# Altium project MiniPC MB GOST.PrjPcb (part 23 of 31)

## Sheet SFP Connector.SchDoc
size 209 x 297 mm; Author: ALTIUM GOSTBOM2.0 KEV; SheetNumber: 31; SheetTotal: 48
Used 2 times, as channels A10/AB17, A10/AB18. Parts and nets are listed once, with the designators drawn on the sheet.
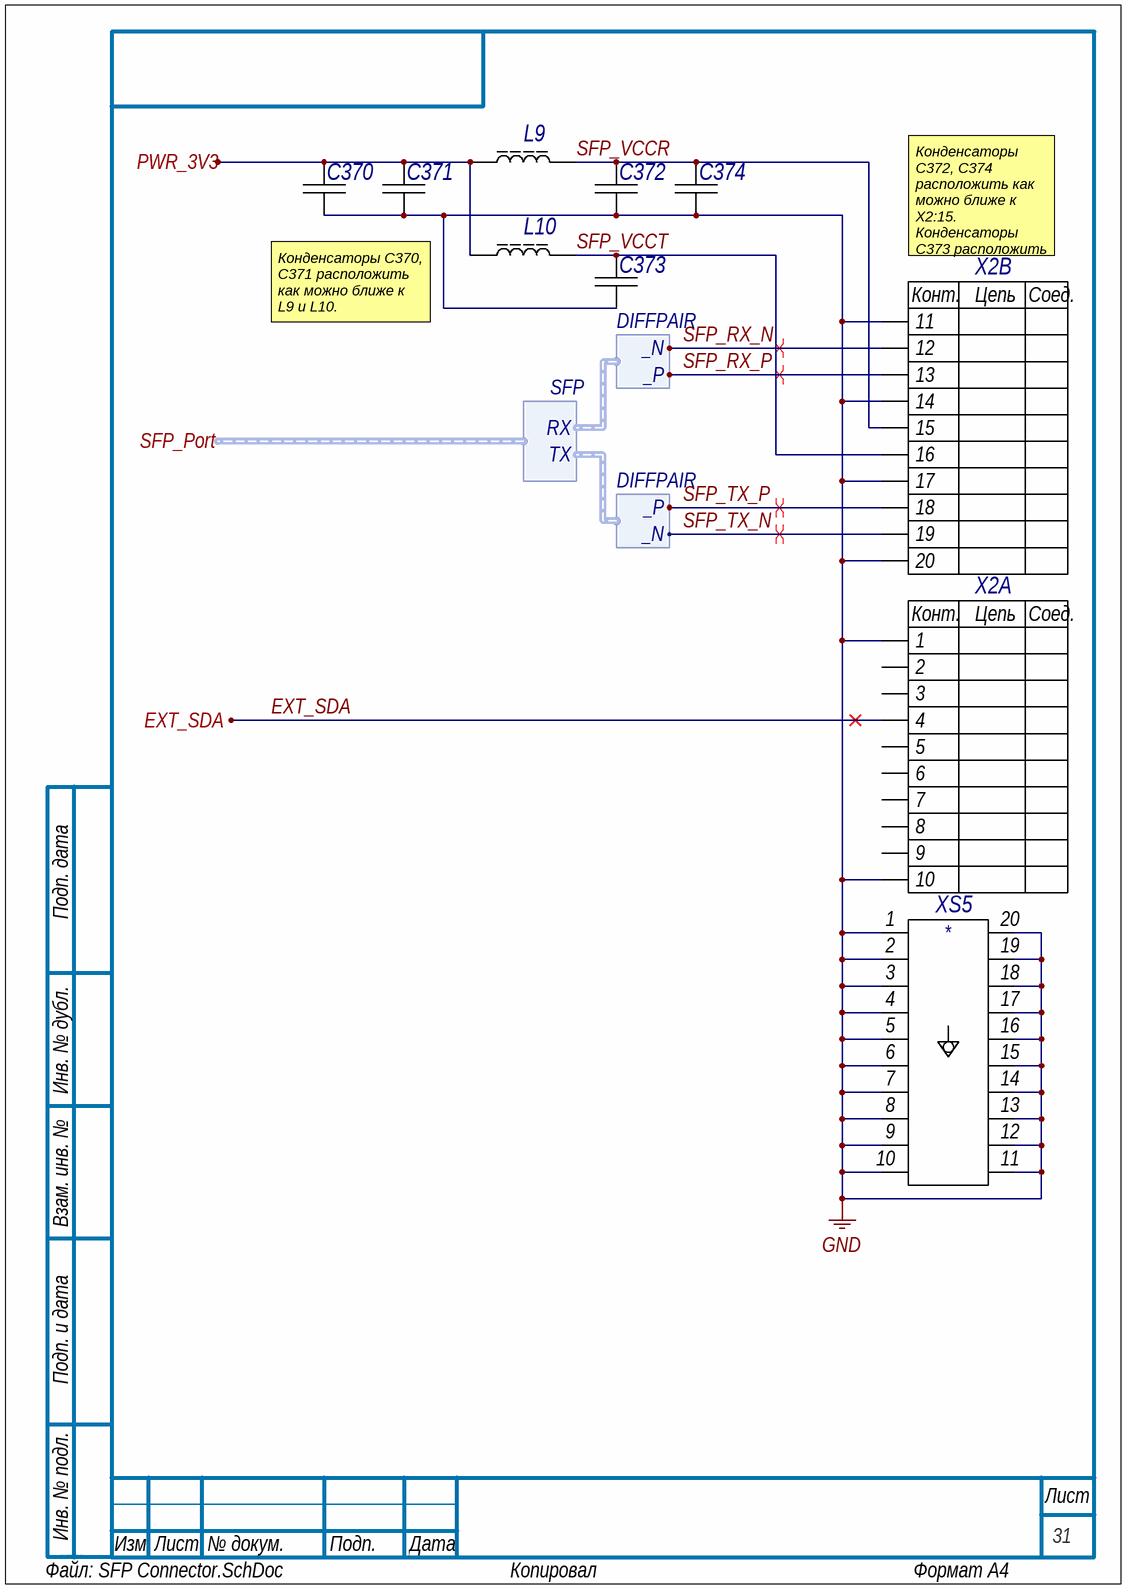
[diagram p32: SFP Connector.SchDoc]

### Parts
C370  C1005X7R1E104M  [CAPC1005X55X10LL05]  (value not drawn)
C371  C2012X5R1C106K085AC  [CAPC2013X100X20NL20]  (value not drawn)
C372  C1005X7R1E104M  [CAPC1005X55X10LL05]  (value not drawn)
C373  C1005X7R1E104M  [CAPC1005X55X10LL05]  (value not drawn)
C374  C2012X5R1C106K085AC  [CAPC2013X100X20NL20]  (value not drawn)
L9  1008CS-102XFLC  [COIL-1008CS_V]  (value not drawn)
L10  1008CS-102XFLC  [COIL-1008CS_V]  (value not drawn)
X2  MECT-110-01-M-D-RA1  [SMTC-MECT-110-01-M-D-RA1_V]  (value not drawn)  (parts A,B of 2)
XS5  74754-0101  [MOLX-74754-0101_V]  (value not drawn)

### Ports
EXT_SDA, PWR_3V3, SFP_Port (harness SFP)

### Harnesses
DIFFPAIR: _P, _N
SFP: RX, TX

### Nets
GND: C370.1 C371.1 C372.1 C373.1 C374.1 X2.1 X2.10 X2.11 X2.14 X2.17 X2.20 XS5.1 XS5.2 XS5.3 XS5.4 XS5.5 XS5.6 XS5.7 XS5.8 XS5.9 XS5.10 XS5.11 XS5.12 XS5.13 XS5.14 XS5.15 XS5.16 XS5.17 XS5.18 XS5.19 XS5.20
EXT_SDA: X2.4 ; port EXT_SDA
PWR_3V3: C370.2 C371.2 L9.1 L10.1 ; port PWR_3V3
SFP_RX_N: X2.12 ; harness DIFFPAIR._N
SFP_RX_P: X2.13 ; harness DIFFPAIR._P
SFP_TX_N: X2.19 ; harness DIFFPAIR._N
SFP_TX_P: X2.18 ; harness DIFFPAIR._P
SFP_VCCR: C372.2 C374.2 L9.2 X2.15  [project net SFP_VCCR_31]
SFP_VCCT: C373.2 L10.2 X2.16  [project net SFP_VCCT_31]

Not connected (* = marked no-connect by the designer): X2 2 3 5 6 7 8 9

### Channels
A10/AB17: designators C370=AB1C370 C371=AB1C371 C372=AB1C372 C373=AB1C373 C374=AB1C374 L9=AB1L9 L10=AB1L10 X2=AB1X2 XS5=AB1XS5; ports EXT_SDA=EXT_SDA PWR_3V3=IO_3V3
A10/AB18: designators C370=AB2C370 C371=AB2C371 C372=AB2C372 C373=AB2C373 C374=AB2C374 L9=AB2L9 L10=AB2L10 X2=AB2X2 XS5=AB2XS5; ports EXT_SDA=EXT_SDA_AB18 PWR_3V3=IO_3V3

### Layout directives
differential pair: SFP_RX_N_AB17, SFP_RX_P_AB17, SFP_TX_N_AB17, SFP_TX_P_AB17

### Notes on the sheet
- Конденсаторы C372, C374 расположить как можно ближе к X2:15.
  Конденсаторы C373 расположить как можно ближе к X2:16.
- Конденсаторы C370, C371 расположить как можно ближе к L9 и L10.
- Подп. дата
- Инв. № дубл.
- Взам. инв. №
- Подп. и дата
- Инв. № подл.
- Изм.
- Лист
- № докум.
- Подп.
- Дата
- Файл:
- ALTIUM GOSTBOM2.0 KEV
- Копировал
- Формат А4
- (in symbol E35, part A) Конт.; Цепь; Соед.
- (in symbol E35, part B) Конт.; Цепь; Соед.

### Library data of the parts
C370 = E11: Chip Capacitor, 0.1 uF, +/- 20%, 25 V, -55 to 125 degC, 0402 (1005 Metric), RoHS, Tape and Reel; Тип элемента: Конденсатор; Capacitance: 100 nF; Case\/Package: 0402; Type (Capacitors): X7R; Voltage Rating: 25 V; Old_des: C551; New_des: C379; UID: E11; Component Kind: Standard; Case Code (Imperial): 0402; Case Code (Metric): 1005; ComponentLink1Description: Manufacturer URL; ComponentLink1URL: http://www.tdk.com/; ComponentLink2Description: Datasheet; ComponentLink2URL: http://www.farnell.com/datasheets/1571323.pdf; DatasheetVersion: 09/2011; Length: 1 mm; Max Operating Temperature: 125 degC; Min Operating Temperature: -55 degC; Mounting Technology: Surface Mount; Package Quantity: 10000; PackageDescription: 2-Pin Surface Mount Device, Body 1 x 0.5 mm; Packaging: Tape and Reel; PartNumber: C1005X7R1E104M; RoHSCompliant: true; Tolerance: 20%; Width: 0.5 mm; Height: 0.5 mm; Mount: Surface Mount; PackageReference: 0402; Pins: 2; Voltage Rating (DC): 25 V
C371 = E25: Chip Capacitor, 10 uF, +/- 10%, 16 V, -55 to 85 degC, 0805 (2012 Metric), RoHS, Tape and Reel; Тип элемента: Конденсатор; Capacitance: 10 uF; Case\/Package: 0805; Type (Capacitors): X5R; Voltage Rating: 16 V; Old_des: C552; New_des: C380; UID: E25; Component Kind: Standard; Case Code (Imperial): 0805; Case Code (Metric): 2012; ComponentLink1Description: Manufacturer URL; ComponentLink1URL: http://www.tdk.com/; ComponentLink2Description: Datasheet; ComponentLink2URL: https://product.tdk.com/info/en/catalog/datasheets/mlcc_commercial_general_en.pdf; DatasheetVersion: 03/2015; Length: 2 mm; Max Operating Temperature: 85 degC; Min Operating Temperature: -55 degC; Mounting Technology: Surface Mount; Package Quantity: 1; PackageDescription: 2-Pin Surface Mount Device, Body 2 x 1.25 mm; Packaging: Tape and Reel; RoHSCompliant: true; Tolerance: 10%; Width: 1.25 mm; Height: 0.85 mm; Mount: Surface Mount; PackageReference: 0805; Pins: 2; REACH SVHC: No SVHC; Voltage Rating (DC): 16 V
C372 = E11: Chip Capacitor, 0.1 uF, +/- 20%, 25 V, -55 to 125 degC, 0402 (1005 Metric), RoHS, Tape and Reel; Тип элемента: Конденсатор; Capacitance: 100 nF; Case\/Package: 0402; Type (Capacitors): X7R; Voltage Rating: 25 V; Old_des: C553; New_des: C381; UID: E11; Component Kind: Standard; Case Code (Imperial): 0402; Case Code (Metric): 1005; ComponentLink1Description: Manufacturer URL; ComponentLink1URL: http://www.tdk.com/; ComponentLink2Description: Datasheet; ComponentLink2URL: http://www.farnell.com/datasheets/1571323.pdf; DatasheetVersion: 09/2011; Length: 1 mm; Max Operating Temperature: 125 degC; Min Operating Temperature: -55 degC; Mounting Technology: Surface Mount; Package Quantity: 10000; PackageDescription: 2-Pin Surface Mount Device, Body 1 x 0.5 mm; Packaging: Tape and Reel; PartNumber: C1005X7R1E104M; RoHSCompliant: true; Tolerance: 20%; Width: 0.5 mm; Height: 0.5 mm; Mount: Surface Mount; PackageReference: 0402; Pins: 2; Voltage Rating (DC): 25 V
C373 = E11: Chip Capacitor, 0.1 uF, +/- 20%, 25 V, -55 to 125 degC, 0402 (1005 Metric), RoHS, Tape and Reel; Тип элемента: Конденсатор; Capacitance: 100 nF; Case\/Package: 0402; Type (Capacitors): X7R; Voltage Rating: 25 V; Old_des: C550; New_des: C382; UID: E11; Component Kind: Standard; Case Code (Imperial): 0402; Case Code (Metric): 1005; ComponentLink1Description: Manufacturer URL; ComponentLink1URL: http://www.tdk.com/; ComponentLink2Description: Datasheet; ComponentLink2URL: http://www.farnell.com/datasheets/1571323.pdf; DatasheetVersion: 09/2011; Length: 1 mm; Max Operating Temperature: 125 degC; Min Operating Temperature: -55 degC; Mounting Technology: Surface Mount; Package Quantity: 10000; PackageDescription: 2-Pin Surface Mount Device, Body 1 x 0.5 mm; Packaging: Tape and Reel; PartNumber: C1005X7R1E104M; RoHSCompliant: true; Tolerance: 20%; Width: 0.5 mm; Height: 0.5 mm; Mount: Surface Mount; PackageReference: 0402; Pins: 2; Voltage Rating (DC): 25 V
C374 = E25: Chip Capacitor, 10 uF, +/- 10%, 16 V, -55 to 85 degC, 0805 (2012 Metric), RoHS, Tape and Reel; Тип элемента: Конденсатор; Capacitance: 10 uF; Case\/Package: 0805; Type (Capacitors): X5R; Voltage Rating: 16 V; Old_des: C554; New_des: C383; UID: E25; Component Kind: Standard; Case Code (Imperial): 0805; Case Code (Metric): 2012; ComponentLink1Description: Manufacturer URL; ComponentLink1URL: http://www.tdk.com/; ComponentLink2Description: Datasheet; ComponentLink2URL: https://product.tdk.com/info/en/catalog/datasheets/mlcc_commercial_general_en.pdf; DatasheetVersion: 03/2015; Length: 2 mm; Max Operating Temperature: 85 degC; Min Operating Temperature: -55 degC; Mounting Technology: Surface Mount; Package Quantity: 1; PackageDescription: 2-Pin Surface Mount Device, Body 2 x 1.25 mm; Packaging: Tape and Reel; RoHSCompliant: true; Tolerance: 10%; Width: 1.25 mm; Height: 0.85 mm; Mount: Surface Mount; PackageReference: 0805; Pins: 2; REACH SVHC: No SVHC; Voltage Rating (DC): 16 V
L9 = E49: Chip Inductor, 1000 nH, +/- 1%, -40 to 125 degC, 2-Pin SMD, RoHS, Tape and Reel; Тип элемента: Ферритовый дроссель; Inductance: 1000 nH; Old_des: L24; New_des: L10; UID: E49; Component Kind: Standard; ComponentLink1Description: Manufacturer URL; ComponentLink1URL: http://www.coilcraft.com/; ComponentLink2Description: Datasheet; ComponentLink2URL: http://datasheet.octopart.com/1008CS-102XFLC-Coilcraft-datasheet-10791557.pdf; DatasheetVersion: 01/2012; Mounting Technology: Surface Mount; PackageDescription: 2-Pin Surface Mount Device, Body 2.92 x 2.79 mm; PartNumber: 1008CS-102XFLC; RoHSCompliant: False
L10 = E49: Chip Inductor, 1000 nH, +/- 1%, -40 to 125 degC, 2-Pin SMD, RoHS, Tape and Reel; Тип элемента: Ферритовый дроссель; Inductance: 1000 nH; Old_des: L23; New_des: L11; UID: E49; Component Kind: Standard; ComponentLink1Description: Manufacturer URL; ComponentLink1URL: http://www.coilcraft.com/; ComponentLink2Description: Datasheet; ComponentLink2URL: http://datasheet.octopart.com/1008CS-102XFLC-Coilcraft-datasheet-10791557.pdf; DatasheetVersion: 01/2012; Mounting Technology: Surface Mount; PackageDescription: 2-Pin Surface Mount Device, Body 2.92 x 2.79 mm; PartNumber: 1008CS-102XFLC; RoHSCompliant: False
X2 = E35: Female Transceiver Interface, Pitch 0.8 mm, 2 x 10 Position, Height 5.2 mm, -55 to 125 degC, RoHS, Tube; Manufacturer: Samtec; Тип элемента: Соединитель; Old_des: J7; New_des: X2; UID: E35; Component Kind: Standard; ComponentLink1Description: Manufacturer URL; ComponentLink1URL: http://www.samtec.com/; ComponentLink2Description: Datasheet; ComponentLink2URL: http://suddendocs.samtec.com/catalog_english/mect.pdf; DatasheetVersion: Rev. Feb-16; Mounting Technology: Surface Mount; PackageDescription: Female Transceiver Interface, Pitch 0.8 mm, 2 x 10 Position, Height 5.2 mm; PartNumber: MECT-110-01-M-D-RA1; PackageReference: MECT-110-01-M-D-RA1; ComponentLink3Description: Package Specification; ComponentLink3URL: http://suddendocs.samtec.com/prints/mect-1xx-xx-xx-xx-d-rax-xx-footprint.pdf; PackageVersion: Rev. H, 06/2016
XS5 = E1: SFP+ Cage, Single Port, Height 10.85 mm, Tail Height 3.05 mm, -40 to 85 degC, RoHS, Tray; Manufacturer: Molex; Тип элемента: Корзина соединителя; Old_des: B1; New_des: XS5; UID: E1; Component Kind: Standard; ComponentLink1Description: Manufacturer URL; ComponentLink1URL: http://www.molex.com/; ComponentLink2Description: Datasheet; ComponentLink2URL: http://www.molex.com/webdocs/datasheets/pdf/en-us/0747540101_IO_CONNECTORS.pdf; DatasheetVersion: Rev. Jul-15; Mounting Technology: Through Hole; PackageDescription: SFP+ Cage, Single Port, Height 10.85 mm, Tail Height 3.05 mm; PartNumber: 74754-0101; PackageReference: 74754-0101; ComponentLink3Description: Package Specification; ComponentLink3URL: http://www.molex.com/pdm_docs/sd/747540101_sd.pdf; PackageVersion: Rev. J, 02/2015

## Sheet USB3 Interface.SchDoc
size 420 x 297 mm; Author: ALTIUM GOSTBOM2.0 KEV; SheetNumber: 47; SheetTotal: 48
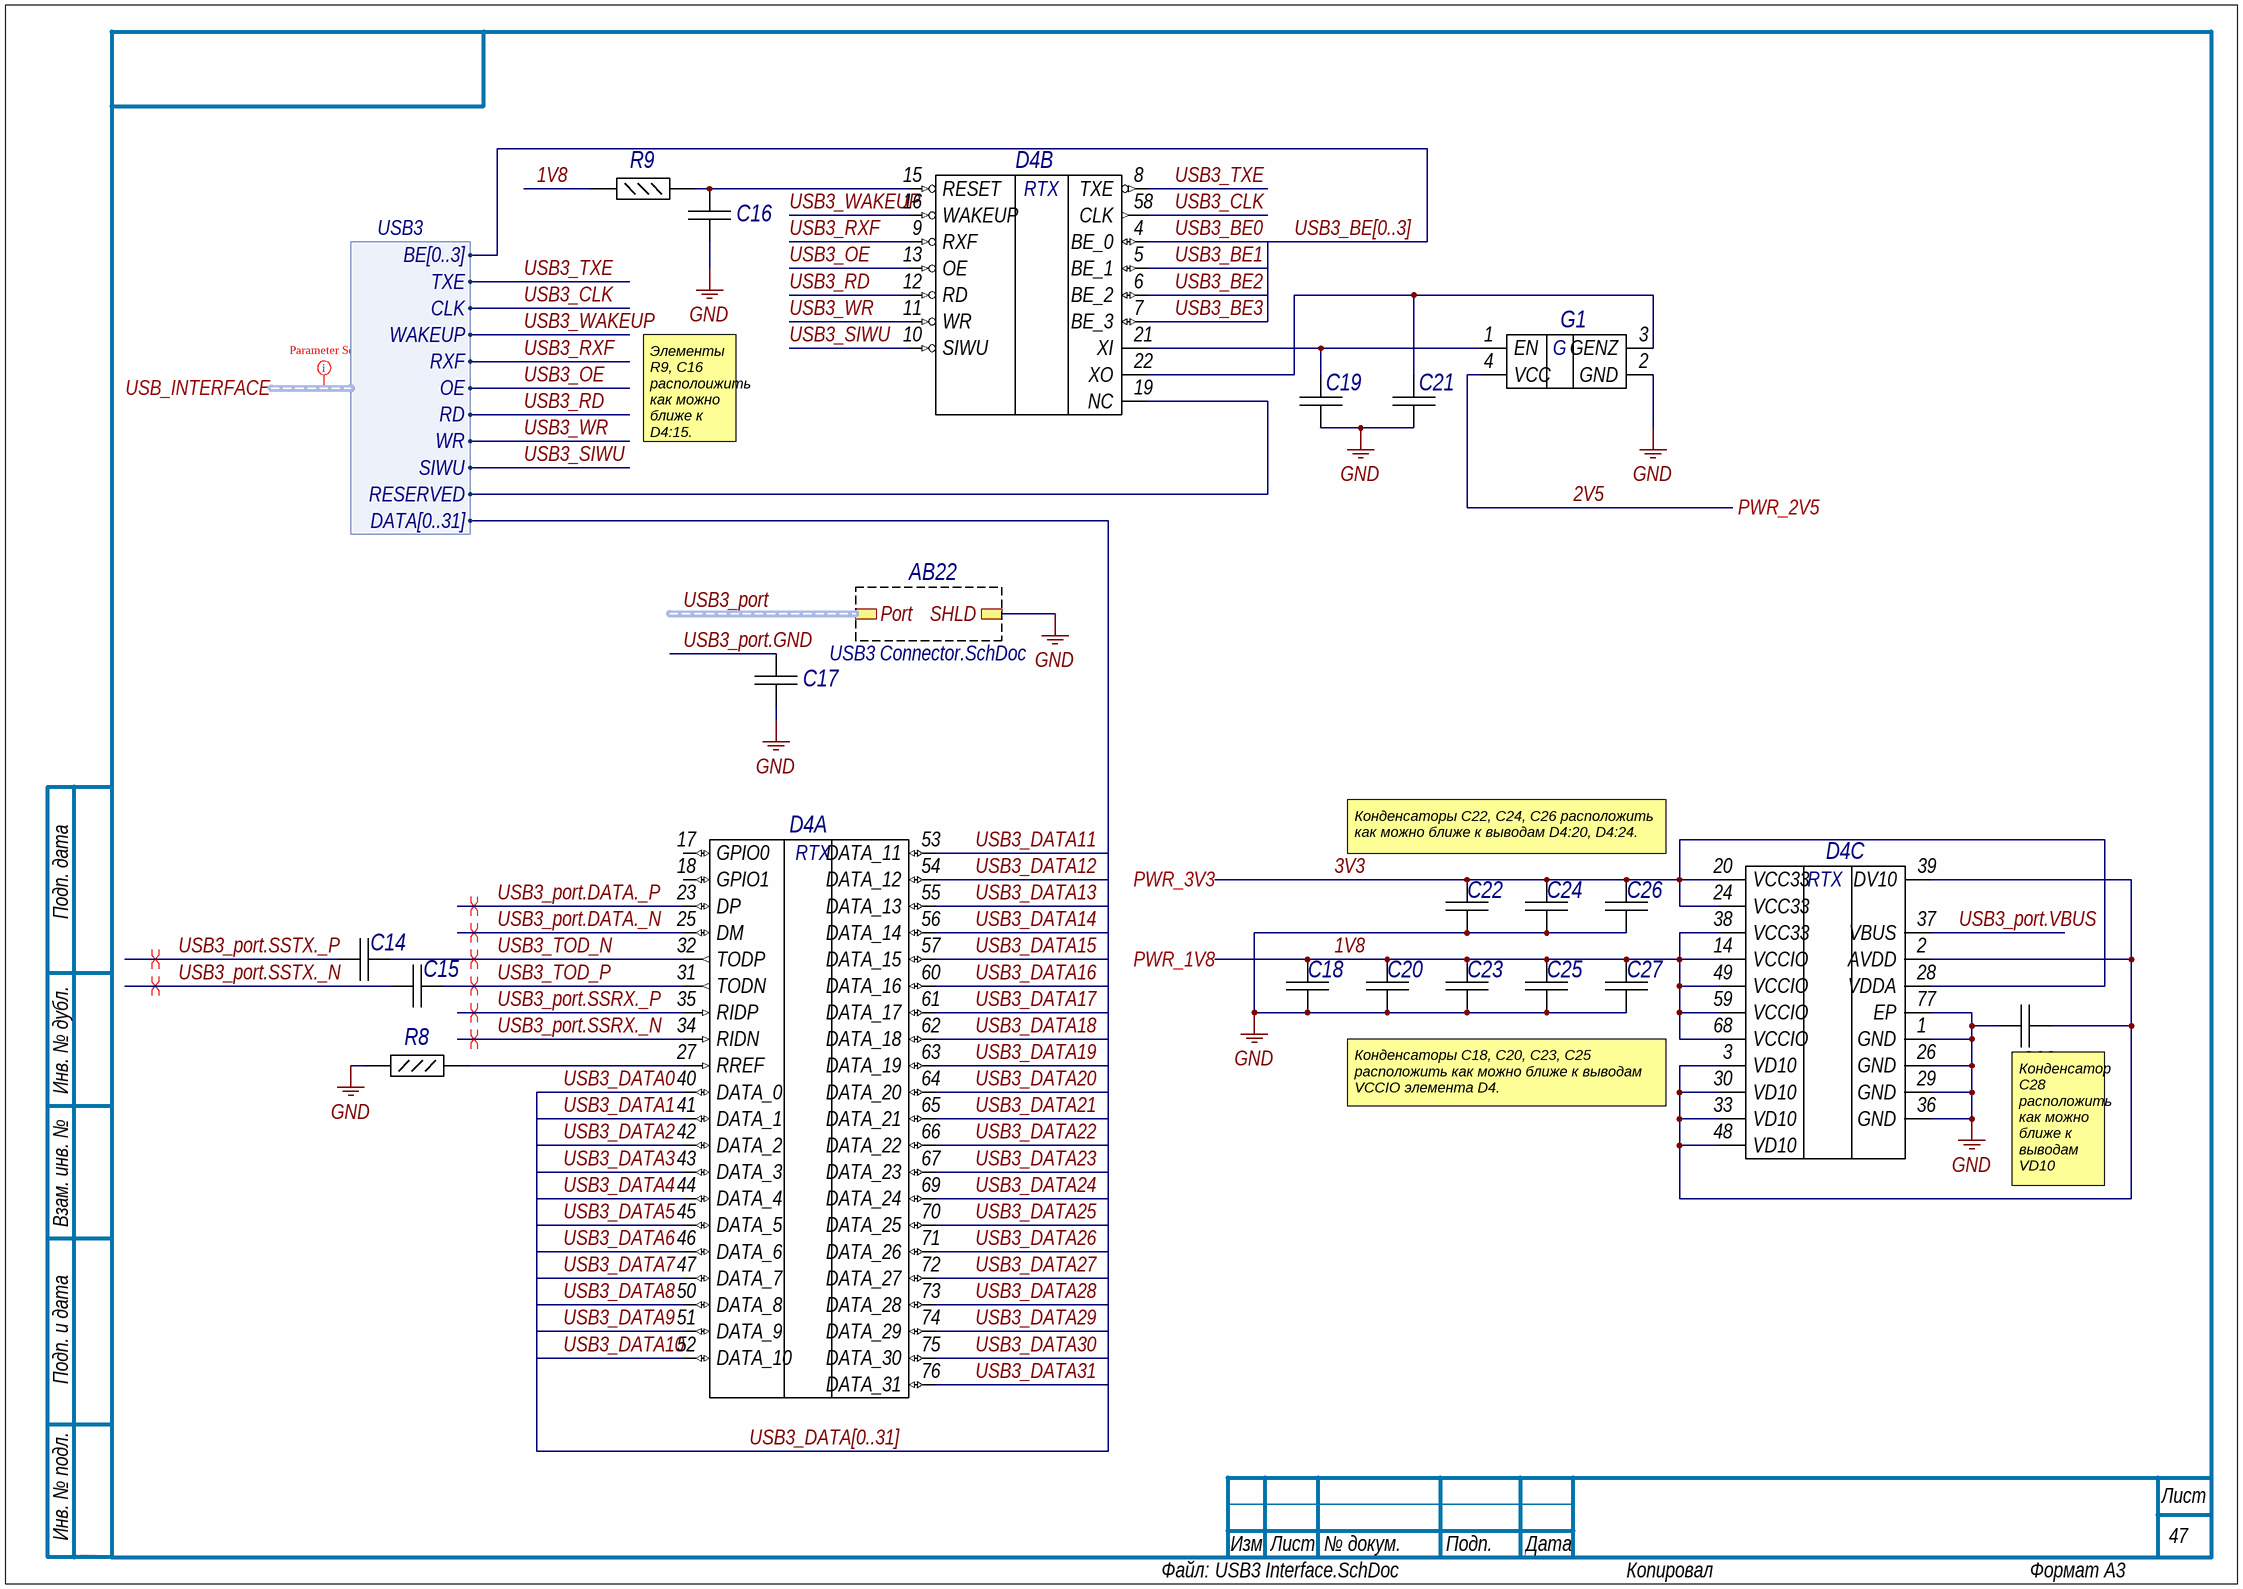
[diagram p33: USB3 Interface.SchDoc]

### Parts
C14  GRM033R60J104KE19D  [CAPC0603X33X15LL03T05]  (value not drawn)
C15  GRM033R60J104KE19D  [CAPC0603X33X15LL03T05]  (value not drawn)
C16  GRM033R60J104KE19D  [CAPC0603X33X15LL03T05]  (value not drawn)
C17  GRM033R60J104KE19D  [CAPC0603X33X15LL03T05]  (value not drawn)
C18  C1005X7R1E104M  [CAPC1005X55X10LL05]  (value not drawn)
C19  GRM033R60J104KE19D  [CAPC0603X33X15LL03T05]  (value not drawn)
C20  C1005X7R1E104M  [CAPC1005X55X10LL05]  (value not drawn)
C21  GRM033R60J104KE19D  [CAPC0603X33X15LL03T05]  (value not drawn)
C22  C1005X7R1E104M  [CAPC1005X55X10LL05]  (value not drawn)
C23  C1005X7R1E104M  [CAPC1005X55X10LL05]  (value not drawn)
C24  C1005X7R1E104M  [CAPC1005X55X10LL05]  (value not drawn)
C25  C1005X7R1E104M  [CAPC1005X55X10LL05]  (value not drawn)
C26  C1005X7R1E104M  [CAPC1005X55X10LL05]  (value not drawn)
C27  C1005X7R1E104M  [CAPC1005X55X10LL05]  (value not drawn)
C28  GRM033R60J104KE19D  [CAPC0603X33X15LL03T05]  (value not drawn)
D4  FT601Q  [FTDI-QFN-76_M]  (value not drawn)  (parts A,B,C of 3)
G1  ASE2-33.000MHZ-ET  [ABRA-ASE2_V]  (value not drawn)
R8  ERJ-2RKF1651X  [RESC1005X40X25LL05T05]  (value not drawn)
R9  ERJ-2RKF1002X  [RESC1005X40X25LL05T05]  (value not drawn)

### Sub-sheets
AB22 = USB3 Connector.SchDoc: Port (harness USB3_typeA), SHLD

### Ports
PWR_1V8, PWR_2V5, PWR_3V3, USB_INTERFACE (harness USB3)

### Harnesses
USB3: DATA[0..31], BE[0..3], TXE, CLK, WAKEUP, RXF, OE, RD, WR, SIWU, RESERVED

### Nets
GND: C16.1 C17.1 C18.1 C19.1 C20.1 C21.1 C22.1 C23.1 C24.1 C25.1 C26.1 C27.1 C28.2 D4.1(GND) D4.26(GND) D4.29(GND) D4.36(GND) D4.77(EP) G1.2(GND) R8.2 ; sheet AB22/SHLD
1V8: C18.2 C20.2 C23.2 C25.2 C27.2 D4.14(VCCIO) D4.38(VCC33) D4.49(VCCIO) D4.59(VCCIO) D4.68(VCCIO) R9.1 ; port PWR_1V8  [project net IO_1V8]
2V5: G1.4(VCC) ; port PWR_2V5  [project net IO_2V5]
3V3: C22.2 C24.2 C26.2 D4.20(VCC33) D4.24(VCC33) D4.28(VDDA) ; port PWR_3V3  [project net IO_3V3]
USB3_BE0: D4.4(BE_0)  [project net USB3_BE0_47]
USB3_BE1: D4.5(BE_1)  [project net USB3_BE1_47]
USB3_BE2: D4.6(BE_2)  [project net USB3_BE2_47]
USB3_BE3: D4.7(BE_3)  [project net USB3_BE3_47]
USB3_CLK: D4.58(CLK) ; port USB_INTERFACE.CLK
USB3_DATA0: D4.40(DATA_0)  [project net USB3_DATA0_47]
USB3_DATA1: D4.41(DATA_1)  [project net USB3_DATA1_47]
USB3_DATA2: D4.42(DATA_2)  [project net USB3_DATA2_47]
USB3_DATA3: D4.43(DATA_3)  [project net USB3_DATA3_47]
USB3_DATA4: D4.44(DATA_4)  [project net USB3_DATA4_47]
USB3_DATA5: D4.45(DATA_5)  [project net USB3_DATA5_47]
USB3_DATA6: D4.46(DATA_6)  [project net USB3_DATA6_47]
USB3_DATA7: D4.47(DATA_7)  [project net USB3_DATA7_47]
USB3_DATA8: D4.50(DATA_8)  [project net USB3_DATA8_47]
USB3_DATA9: D4.51(DATA_9)  [project net USB3_DATA9_47]
USB3_DATA10: D4.52(DATA_10)  [project net USB3_DATA10_47]
USB3_DATA11: D4.53(DATA_11)  [project net USB3_DATA11_47]
USB3_DATA12: D4.54(DATA_12)  [project net USB3_DATA12_47]
USB3_DATA13: D4.55(DATA_13)  [project net USB3_DATA13_47]
USB3_DATA14: D4.56(DATA_14)  [project net USB3_DATA14_47]
USB3_DATA15: D4.57(DATA_15)  [project net USB3_DATA15_47]
USB3_DATA16: D4.60(DATA_16)  [project net USB3_DATA16_47]
USB3_DATA17: D4.61(DATA_17)  [project net USB3_DATA17_47]
USB3_DATA18: D4.62(DATA_18)  [project net USB3_DATA18_47]
USB3_DATA19: D4.63(DATA_19)  [project net USB3_DATA19_47]
USB3_DATA20: D4.64(DATA_20)  [project net USB3_DATA20_47]
USB3_DATA21: D4.65(DATA_21)  [project net USB3_DATA21_47]
USB3_DATA22: D4.66(DATA_22)  [project net USB3_DATA22_47]
USB3_DATA23: D4.67(DATA_23)  [project net USB3_DATA23_47]
USB3_DATA24: D4.69(DATA_24)  [project net USB3_DATA24_47]
USB3_DATA25: D4.70(DATA_25)  [project net USB3_DATA25_47]
USB3_DATA26: D4.71(DATA_26)  [project net USB3_DATA26_47]
USB3_DATA27: D4.72(DATA_27)  [project net USB3_DATA27_47]
USB3_DATA28: D4.73(DATA_28)  [project net USB3_DATA28_47]
USB3_DATA29: D4.74(DATA_29)  [project net USB3_DATA29_47]
USB3_DATA30: D4.75(DATA_30)  [project net USB3_DATA30_47]
USB3_DATA31: D4.76(DATA_31)  [project net USB3_DATA31_47]
USB3_OE: D4.13(OE) ; port USB_INTERFACE.OE
USB3_port.DATA._N: D4.25(DM)  [project net USB3_port.DATA._N_47]
USB3_port.DATA._P: D4.23(DP)  [project net USB3_port.DATA._P_47]
USB3_port.GND: C17.2  [project net USB3_port.GND_47]
USB3_port.SSRX._N: D4.34(RIDN)  [project net USB3_port.SSRX._N_47]
USB3_port.SSRX._P: D4.35(RIDP)  [project net USB3_port.SSRX._P_47]
USB3_port.SSTX._N: C15.2  [project net USB3_port.SSTX._N_47]
USB3_port.SSTX._P: C14.2  [project net USB3_port.SSTX._P_47]
USB3_port.VBUS: D4.37(VBUS)  [project net USB3_port.VBUS_47]
USB3_RD: D4.12(RD) ; port USB_INTERFACE.RD
USB3_RXF: D4.9(RXF) ; port USB_INTERFACE.RXF
USB3_SIWU: D4.10(SIWU) ; port USB_INTERFACE.SIWU
USB3_TOD_N: C14.1 D4.32(TODP)  [project net USB3_TOD_N_47]
USB3_TOD_P: C15.1 D4.31(TODN)  [project net USB3_TOD_P_47]
USB3_TXE: D4.8(TXE) ; port USB_INTERFACE.TXE
USB3_WAKEUP: D4.16(WAKEUP) ; port USB_INTERFACE.WAKEUP
USB3_WR: D4.11(WR) ; port USB_INTERFACE.WR
NetC16_2: C16.2 D4.15(RESET) R9.2
NetC19_2: C19.2 D4.21(XI) G1.1(EN)
NetC21_2: C21.2 D4.22(XO) G1.3(GENZ)
NetC28_1: C28.1 D4.2(AVDD) D4.3(VD10) D4.30(VD10) D4.33(VD10) D4.39(DV10) D4.48(VD10)
NetD4_19: D4.19(NC) ; port USB_INTERFACE.RESERVED
NetD4_27: D4.27(RREF) R8.1

Not connected (* = marked no-connect by the designer): D4 17(GPIO0) 18(GPIO1)

### Buses and harness runs
bus USB3_BE[0..3]
bus USB3_DATA[0..31]
harness USB3_port = sheet AB22/Port

### Layout directives
differential pair: USB3_port.DATA._N_47, USB3_port.DATA._P_47, USB3_port.SSRX._N_47, USB3_port.SSRX._P_47, USB3_port.SSTX._N_47, USB3_port.SSTX._P_47, USB3_TOD_N_47, USB3_TOD_P_47
net class USB3: (no net found under the mark)

### Notes on the sheet
- Элементы R9, C16 располоижить как можно ближе к D4:15.
- Конденсаторы C22, C24, C26 расположить как можно ближе к выводам D4:20, D4:24.
- Конденсаторы C18, C20, C23, C25 расположить как можно ближе к выводам VCCIO элемента D4.
  Конденсатор C27 расположить как можно ближе к D4:28.
- (near C28) Конденсатор C28 расположить как можно ближе к выводам VD10 элемента D4.
- Подп. дата
- Инв. № дубл.
- Взам. инв. №
- Подп. и дата
- Инв. № подл.
- Изм.
- Лист
- № докум.
- Подп.
- Дата
- ALTIUM GOSTBOM2.0 KEV
- Файл:
- Копировал
- Формат А3
- (in symbol E127, part A) RTX
- (in symbol E127, part B) RTX
- (in symbol E127, part C) RTX
- (in symbol E128) G

### Library data of the parts
C14 = E22: Chip Capacitor, 100 nF, +/- 10%, 6.3 V, -55 to 85 degC, 0201 (0603 Metric), RoHS, Tape and Reel; Manufacturer: Basic Passives; Тип элемента: Конденсатор; Capacitance: 100 nF; Case\/Package: 0201; Type (Capacitors): X5R; Voltage Rating: 6.3 V; Voltage Rating (DC): 3 V; Old_des: C561; New_des: C14; UID: E22; Component Kind: Standard; Case Code (Imperial): 0201; Case Code (Metric): 0603; ComponentLink1Description: Manufacturer URL; ComponentLink1URL: http://www.murata.com/; ComponentLink2Description: Datasheet; ComponentLink2URL: http://search.murata.co.jp/Ceramy/image/img/A01X/G101/ENG/GRM033R60J104KE19-01.pdf; DatasheetVersion: 03/2016; Length: 0.6 mm; Max Operating Temperature: 85 degC; Min Operating Temperature: -55 degC; Mounting Technology: Surface Mount; Package Quantity: 15000; PackageDescription: 2-Pin Surface Mount Device, Body 0.6 x 0.3 mm; Packaging: Tape and Reel; PartNumber: GRM033R60J104KE19D; RoHSCompliant: true; Tolerance: 10%; Width: 0.3 mm; Height: 0.3 mm; Mount: Surface Mount; PackageReference: 0201; Pins: 2; Radiation Hardening: No; REACH SVHC: No SVHC
C15 = E22: Chip Capacitor, 100 nF, +/- 10%, 6.3 V, -55 to 85 degC, 0201 (0603 Metric), RoHS, Tape and Reel; Manufacturer: Basic Passives; Тип элемента: Конденсатор; Capacitance: 100 nF; Case\/Package: 0201; Type (Capacitors): X5R; Voltage Rating: 6.3 V; Voltage Rating (DC): 3 V; Old_des: C560; New_des: C15; UID: E22; Component Kind: Standard; Case Code (Imperial): 0201; Case Code (Metric): 0603; ComponentLink1Description: Manufacturer URL; ComponentLink1URL: http://www.murata.com/; ComponentLink2Description: Datasheet; ComponentLink2URL: http://search.murata.co.jp/Ceramy/image/img/A01X/G101/ENG/GRM033R60J104KE19-01.pdf; DatasheetVersion: 03/2016; Length: 0.6 mm; Max Operating Temperature: 85 degC; Min Operating Temperature: -55 degC; Mounting Technology: Surface Mount; Package Quantity: 15000; PackageDescription: 2-Pin Surface Mount Device, Body 0.6 x 0.3 mm; Packaging: Tape and Reel; PartNumber: GRM033R60J104KE19D; RoHSCompliant: true; Tolerance: 10%; Width: 0.3 mm; Height: 0.3 mm; Mount: Surface Mount; PackageReference: 0201; Pins: 2; Radiation Hardening: No; REACH SVHC: No SVHC
C16 = E22: Chip Capacitor, 100 nF, +/- 10%, 6.3 V, -55 to 85 degC, 0201 (0603 Metric), RoHS, Tape and Reel; Manufacturer: Basic Passives; Тип элемента: Конденсатор; Capacitance: 100 nF; Case\/Package: 0201; Type (Capacitors): X5R; Voltage Rating: 6.3 V; Voltage Rating (DC): 3 V; Old_des: C563; New_des: C16; UID: E22; Component Kind: Standard; Case Code (Imperial): 0201; Case Code (Metric): 0603; ComponentLink1Description: Manufacturer URL; ComponentLink1URL: http://www.murata.com/; ComponentLink2Description: Datasheet; ComponentLink2URL: http://search.murata.co.jp/Ceramy/image/img/A01X/G101/ENG/GRM033R60J104KE19-01.pdf; DatasheetVersion: 03/2016; Length: 0.6 mm; Max Operating Temperature: 85 degC; Min Operating Temperature: -55 degC; Mounting Technology: Surface Mount; Package Quantity: 15000; PackageDescription: 2-Pin Surface Mount Device, Body 0.6 x 0.3 mm; Packaging: Tape and Reel; PartNumber: GRM033R60J104KE19D; RoHSCompliant: true; Tolerance: 10%; Width: 0.3 mm; Height: 0.3 mm; Mount: Surface Mount; PackageReference: 0201; Pins: 2; Radiation Hardening: No; REACH SVHC: No SVHC
C17 = E22: Chip Capacitor, 100 nF, +/- 10%, 6.3 V, -55 to 85 degC, 0201 (0603 Metric), RoHS, Tape and Reel; Manufacturer: Basic Passives; Тип элемента: Конденсатор; Capacitance: 100 nF; Case\/Package: 0201; Type (Capacitors): X5R; Voltage Rating: 6.3 V; Voltage Rating (DC): 3 V; Old_des: C562; New_des: C17; UID: E22; Component Kind: Standard; Case Code (Imperial): 0201; Case Code (Metric): 0603; ComponentLink1Description: Manufacturer URL; ComponentLink1URL: http://www.murata.com/; ComponentLink2Description: Datasheet; ComponentLink2URL: http://search.murata.co.jp/Ceramy/image/img/A01X/G101/ENG/GRM033R60J104KE19-01.pdf; DatasheetVersion: 03/2016; Length: 0.6 mm; Max Operating Temperature: 85 degC; Min Operating Temperature: -55 degC; Mounting Technology: Surface Mount; Package Quantity: 15000; PackageDescription: 2-Pin Surface Mount Device, Body 0.6 x 0.3 mm; Packaging: Tape and Reel; PartNumber: GRM033R60J104KE19D; RoHSCompliant: true; Tolerance: 10%; Width: 0.3 mm; Height: 0.3 mm; Mount: Surface Mount; PackageReference: 0201; Pins: 2; Radiation Hardening: No; REACH SVHC: No SVHC
C18 = E11: Chip Capacitor, 0.1 uF, +/- 20%, 25 V, -55 to 125 degC, 0402 (1005 Metric), RoHS, Tape and Reel; Тип элемента: Конденсатор; Capacitance: 100 nF; Case\/Package: 0402; Type (Capacitors): X7R; Voltage Rating: 25 V; Old_des: C570; New_des: C18; UID: E11; Component Kind: Standard; Case Code (Imperial): 0402; Case Code (Metric): 1005; ComponentLink1Description: Manufacturer URL; ComponentLink1URL: http://www.tdk.com/; ComponentLink2Description: Datasheet; ComponentLink2URL: http://www.farnell.com/datasheets/1571323.pdf; DatasheetVersion: 09/2011; Length: 1 mm; Max Operating Temperature: 125 degC; Min Operating Temperature: -55 degC; Mounting Technology: Surface Mount; Package Quantity: 10000; PackageDescription: 2-Pin Surface Mount Device, Body 1 x 0.5 mm; Packaging: Tape and Reel; PartNumber: C1005X7R1E104M; RoHSCompliant: true; Tolerance: 20%; Width: 0.5 mm; Height: 0.5 mm; Mount: Surface Mount; PackageReference: 0402; Pins: 2; Voltage Rating (DC): 25 V
C19 = E22: Chip Capacitor, 100 nF, +/- 10%, 6.3 V, -55 to 85 degC, 0201 (0603 Metric), RoHS, Tape and Reel; Manufacturer: Basic Passives; Тип элемента: Конденсатор; Capacitance: 100 nF; Case\/Package: 0201; Type (Capacitors): X5R; Voltage Rating: 6.3 V; Voltage Rating (DC): 3 V; Old_des: C564; New_des: C19; UID: E22; Component Kind: Standard; Case Code (Imperial): 0201; Case Code (Metric): 0603; ComponentLink1Description: Manufacturer URL; ComponentLink1URL: http://www.murata.com/; ComponentLink2Description: Datasheet; ComponentLink2URL: http://search.murata.co.jp/Ceramy/image/img/A01X/G101/ENG/GRM033R60J104KE19-01.pdf; DatasheetVersion: 03/2016; Length: 0.6 mm; Max Operating Temperature: 85 degC; Min Operating Temperature: -55 degC; Mounting Technology: Surface Mount; Package Quantity: 15000; PackageDescription: 2-Pin Surface Mount Device, Body 0.6 x 0.3 mm; Packaging: Tape and Reel; PartNumber: GRM033R60J104KE19D; RoHSCompliant: true; Tolerance: 10%; Width: 0.3 mm; Height: 0.3 mm; Mount: Surface Mount; PackageReference: 0201; Pins: 2; Radiation Hardening: No; REACH SVHC: No SVHC
C20 = E11: Chip Capacitor, 0.1 uF, +/- 20%, 25 V, -55 to 125 degC, 0402 (1005 Metric), RoHS, Tape and Reel; Тип элемента: Конденсатор; Capacitance: 100 nF; Case\/Package: 0402; Type (Capacitors): X7R; Voltage Rating: 25 V; Old_des: C571; New_des: C20; UID: E11; Component Kind: Standard; Case Code (Imperial): 0402; Case Code (Metric): 1005; ComponentLink1Description: Manufacturer URL; ComponentLink1URL: http://www.tdk.com/; ComponentLink2Description: Datasheet; ComponentLink2URL: http://www.farnell.com/datasheets/1571323.pdf; DatasheetVersion: 09/2011; Length: 1 mm; Max Operating Temperature: 125 degC; Min Operating Temperature: -55 degC; Mounting Technology: Surface Mount; Package Quantity: 10000; PackageDescription: 2-Pin Surface Mount Device, Body 1 x 0.5 mm; Packaging: Tape and Reel; PartNumber: C1005X7R1E104M; RoHSCompliant: true; Tolerance: 20%; Width: 0.5 mm; Height: 0.5 mm; Mount: Surface Mount; PackageReference: 0402; Pins: 2; Voltage Rating (DC): 25 V
C21 = E22: Chip Capacitor, 100 nF, +/- 10%, 6.3 V, -55 to 85 degC, 0201 (0603 Metric), RoHS, Tape and Reel; Manufacturer: Basic Passives; Тип элемента: Конденсатор; Capacitance: 100 nF; Case\/Package: 0201; Type (Capacitors): X5R; Voltage Rating: 6.3 V; Voltage Rating (DC): 3 V; Old_des: C565; New_des: C21; UID: E22; Component Kind: Standard; Case Code (Imperial): 0201; Case Code (Metric): 0603; ComponentLink1Description: Manufacturer URL; ComponentLink1URL: http://www.murata.com/; ComponentLink2Description: Datasheet; ComponentLink2URL: http://search.murata.co.jp/Ceramy/image/img/A01X/G101/ENG/GRM033R60J104KE19-01.pdf; DatasheetVersion: 03/2016; Length: 0.6 mm; Max Operating Temperature: 85 degC; Min Operating Temperature: -55 degC; Mounting Technology: Surface Mount; Package Quantity: 15000; PackageDescription: 2-Pin Surface Mount Device, Body 0.6 x 0.3 mm; Packaging: Tape and Reel; PartNumber: GRM033R60J104KE19D; RoHSCompliant: true; Tolerance: 10%; Width: 0.3 mm; Height: 0.3 mm; Mount: Surface Mount; PackageReference: 0201; Pins: 2; Radiation Hardening: No; REACH SVHC: No SVHC
C22 = E11: Chip Capacitor, 0.1 uF, +/- 20%, 25 V, -55 to 125 degC, 0402 (1005 Metric), RoHS, Tape and Reel; Тип элемента: Конденсатор; Capacitance: 100 nF; Case\/Package: 0402; Type (Capacitors): X7R; Voltage Rating: 25 V; Old_des: C566; New_des: C22; UID: E11; Component Kind: Standard; Case Code (Imperial): 0402; Case Code (Metric): 1005; ComponentLink1Description: Manufacturer URL; ComponentLink1URL: http://www.tdk.com/; ComponentLink2Description: Datasheet; ComponentLink2URL: http://www.farnell.com/datasheets/1571323.pdf; DatasheetVersion: 09/2011; Length: 1 mm; Max Operating Temperature: 125 degC; Min Operating Temperature: -55 degC; Mounting Technology: Surface Mount; Package Quantity: 10000; PackageDescription: 2-Pin Surface Mount Device, Body 1 x 0.5 mm; Packaging: Tape and Reel; PartNumber: C1005X7R1E104M; RoHSCompliant: true; Tolerance: 20%; Width: 0.5 mm; Height: 0.5 mm; Mount: Surface Mount; PackageReference: 0402; Pins: 2; Voltage Rating (DC): 25 V
C23 = E11: Chip Capacitor, 0.1 uF, +/- 20%, 25 V, -55 to 125 degC, 0402 (1005 Metric), RoHS, Tape and Reel; Тип элемента: Конденсатор; Capacitance: 100 nF; Case\/Package: 0402; Type (Capacitors): X7R; Voltage Rating: 25 V; Old_des: C572; New_des: C23; UID: E11; Component Kind: Standard; Case Code (Imperial): 0402; Case Code (Metric): 1005; ComponentLink1Description: Manufacturer URL; ComponentLink1URL: http://www.tdk.com/; ComponentLink2Description: Datasheet; ComponentLink2URL: http://www.farnell.com/datasheets/1571323.pdf; DatasheetVersion: 09/2011; Length: 1 mm; Max Operating Temperature: 125 degC; Min Operating Temperature: -55 degC; Mounting Technology: Surface Mount; Package Quantity: 10000; PackageDescription: 2-Pin Surface Mount Device, Body 1 x 0.5 mm; Packaging: Tape and Reel; PartNumber: C1005X7R1E104M; RoHSCompliant: true; Tolerance: 20%; Width: 0.5 mm; Height: 0.5 mm; Mount: Surface Mount; PackageReference: 0402; Pins: 2; Voltage Rating (DC): 25 V
C24 = E11: Chip Capacitor, 0.1 uF, +/- 20%, 25 V, -55 to 125 degC, 0402 (1005 Metric), RoHS, Tape and Reel; Тип элемента: Конденсатор; Capacitance: 100 nF; Case\/Package: 0402; Type (Capacitors): X7R; Voltage Rating: 25 V; Old_des: C567; New_des: C24; UID: E11; Component Kind: Standard; Case Code (Imperial): 0402; Case Code (Metric): 1005; ComponentLink1Description: Manufacturer URL; ComponentLink1URL: http://www.tdk.com/; ComponentLink2Description: Datasheet; ComponentLink2URL: http://www.farnell.com/datasheets/1571323.pdf; DatasheetVersion: 09/2011; Length: 1 mm; Max Operating Temperature: 125 degC; Min Operating Temperature: -55 degC; Mounting Technology: Surface Mount; Package Quantity: 10000; PackageDescription: 2-Pin Surface Mount Device, Body 1 x 0.5 mm; Packaging: Tape and Reel; PartNumber: C1005X7R1E104M; RoHSCompliant: true; Tolerance: 20%; Width: 0.5 mm; Height: 0.5 mm; Mount: Surface Mount; PackageReference: 0402; Pins: 2; Voltage Rating (DC): 25 V
C25 = E11: Chip Capacitor, 0.1 uF, +/- 20%, 25 V, -55 to 125 degC, 0402 (1005 Metric), RoHS, Tape and Reel; Тип элемента: Конденсатор; Capacitance: 100 nF; Case\/Package: 0402; Type (Capacitors): X7R; Voltage Rating: 25 V; Old_des: C573; New_des: C25; UID: E11; Component Kind: Standard; Case Code (Imperial): 0402; Case Code (Metric): 1005; ComponentLink1Description: Manufacturer URL; ComponentLink1URL: http://www.tdk.com/; ComponentLink2Description: Datasheet; ComponentLink2URL: http://www.farnell.com/datasheets/1571323.pdf; DatasheetVersion: 09/2011; Length: 1 mm; Max Operating Temperature: 125 degC; Min Operating Temperature: -55 degC; Mounting Technology: Surface Mount; Package Quantity: 10000; PackageDescription: 2-Pin Surface Mount Device, Body 1 x 0.5 mm; Packaging: Tape and Reel; PartNumber: C1005X7R1E104M; RoHSCompliant: true; Tolerance: 20%; Width: 0.5 mm; Height: 0.5 mm; Mount: Surface Mount; PackageReference: 0402; Pins: 2; Voltage Rating (DC): 25 V
C26 = E11: Chip Capacitor, 0.1 uF, +/- 20%, 25 V, -55 to 125 degC, 0402 (1005 Metric), RoHS, Tape and Reel; Тип элемента: Конденсатор; Capacitance: 100 nF; Case\/Package: 0402; Type (Capacitors): X7R; Voltage Rating: 25 V; Old_des: C568; New_des: C26; UID: E11; Component Kind: Standard; Case Code (Imperial): 0402; Case Code (Metric): 1005; ComponentLink1Description: Manufacturer URL; ComponentLink1URL: http://www.tdk.com/; ComponentLink2Description: Datasheet; ComponentLink2URL: http://www.farnell.com/datasheets/1571323.pdf; DatasheetVersion: 09/2011; Length: 1 mm; Max Operating Temperature: 125 degC; Min Operating Temperature: -55 degC; Mounting Technology: Surface Mount; Package Quantity: 10000; PackageDescription: 2-Pin Surface Mount Device, Body 1 x 0.5 mm; Packaging: Tape and Reel; PartNumber: C1005X7R1E104M; RoHSCompliant: true; Tolerance: 20%; Width: 0.5 mm; Height: 0.5 mm; Mount: Surface Mount; PackageReference: 0402; Pins: 2; Voltage Rating (DC): 25 V
C27 = E11: Chip Capacitor, 0.1 uF, +/- 20%, 25 V, -55 to 125 degC, 0402 (1005 Metric), RoHS, Tape and Reel; Тип элемента: Конденсатор; Capacitance: 100 nF; Case\/Package: 0402; Type (Capacitors): X7R; Voltage Rating: 25 V; Old_des: C574; New_des: C27; UID: E11; Component Kind: Standard; Case Code (Imperial): 0402; Case Code (Metric): 1005; ComponentLink1Description: Manufacturer URL; ComponentLink1URL: http://www.tdk.com/; ComponentLink2Description: Datasheet; ComponentLink2URL: http://www.farnell.com/datasheets/1571323.pdf; DatasheetVersion: 09/2011; Length: 1 mm; Max Operating Temperature: 125 degC; Min Operating Temperature: -55 degC; Mounting Technology: Surface Mount; Package Quantity: 10000; PackageDescription: 2-Pin Surface Mount Device, Body 1 x 0.5 mm; Packaging: Tape and Reel; PartNumber: C1005X7R1E104M; RoHSCompliant: true; Tolerance: 20%; Width: 0.5 mm; Height: 0.5 mm; Mount: Surface Mount; PackageReference: 0402; Pins: 2; Voltage Rating (DC): 25 V
C28 = E22: Chip Capacitor, 100 nF, +/- 10%, 6.3 V, -55 to 85 degC, 0201 (0603 Metric), RoHS, Tape and Reel; Manufacturer: Basic Passives; Тип элемента: Конденсатор; Capacitance: 100 nF; Case\/Package: 0201; Type (Capacitors): X5R; Voltage Rating: 6.3 V; Voltage Rating (DC): 3 V; Old_des: C569; New_des: C28; UID: E22; Component Kind: Standard; Case Code (Imperial): 0201; Case Code (Metric): 0603; ComponentLink1Description: Manufacturer URL; ComponentLink1URL: http://www.murata.com/; ComponentLink2Description: Datasheet; ComponentLink2URL: http://search.murata.co.jp/Ceramy/image/img/A01X/G101/ENG/GRM033R60J104KE19-01.pdf; DatasheetVersion: 03/2016; Length: 0.6 mm; Max Operating Temperature: 85 degC; Min Operating Temperature: -55 degC; Mounting Technology: Surface Mount; Package Quantity: 15000; PackageDescription: 2-Pin Surface Mount Device, Body 0.6 x 0.3 mm; Packaging: Tape and Reel; PartNumber: GRM033R60J104KE19D; RoHSCompliant: true; Tolerance: 10%; Width: 0.3 mm; Height: 0.3 mm; Mount: Surface Mount; PackageReference: 0201; Pins: 2; Radiation Hardening: No; REACH SVHC: No SVHC
D4 = E127: 32 Bit USB 3.0 to FIFO Bridge, 5 Gbps, 3 to 3.6 V, -40 to 85 degC, 76-Pin QFN, Pb-Free; Тип элемента: Преобразователь интерфейсов; Old_des: U33; New_des: D4; UID: E127; Component Kind: Standard; ComponentLink1Description: Manufacturer URL; ComponentLink1URL: http://www.ftdichip.com/; ComponentLink2Description: Datasheet; ComponentLink2URL: http://www.ftdichip.com/Support/Documents/DataSheets/ICs/DS_FT600Q-FT601Q%20IC%20Datasheet.pdf; DatasheetVersion: Rev. 1.02, 02/2016; Mounting Technology: Surface Mount; PackageDescription: 76-Pin Quad Flat No-lead Package, Body 9 x 9 mm, Pitch 0.4 mm, Thermal Pad 5.45 x 5.45 mm; RoHSCompliant: false; PackageReference: QFN-76
G1 = E128: CMOS Compatible SMD Crystal Oscillator, 33 MHz, 2.5 V, -20 to 70 degC, 4-Pin SMD, RoHS, Tape and Reel; Manufacturer: Abracon; Тип элемента: Генератор; Old_des: X1; New_des: G1; UID: E128; Component Kind: Standard; ComponentLink1Description: Manufacturer URL; ComponentLink1URL: http://www.abracon.com/; ComponentLink2Description: Datasheet; ComponentLink2URL: http://www.abracon.com/Oscillators/ASE2series.pdf; DatasheetVersion: Rev. Aug-14; Mounting Technology: Surface Mount; PackageDescription: 4-Pin Surface Mount Device, Body 3.2 x 2.5 mm, Pitch 2.1 mm; PartNumber: ASE2-33.000MHZ-ET; PackageReference: ASE2
R8 = E85: Chip Resistor, 1.65 KOhm, +/- 1%, 100 mW, -55 to 155 degC, 0402 (1005 Metric), RoHS, Tape and Reel; Manufacturer: Basic Passives; Тип элемента: Резистор; Case\/Package: 0402; Voltage Rating: 50 V; Power Rating: 100 mW; Old_des: R342; New_des: R8; UID: E85; Component Kind: Standard; Case Code (Imperial): 0402; Case Code (Metric): 1005; ComponentLink1Description: Manufacturer URL; ComponentLink1URL: http://www.panasonic.com/; ComponentLink2Description: Datasheet; ComponentLink2URL: http://industrial.panasonic.com/cdbs/www-data/pdf/RDA0000/AOA0000C86.pdf; DatasheetVersion: 04/2015; Length: 1 mm; Max Operating Temperature: 155 degC; Min Operating Temperature: -55 degC; Mounting Technology: Surface Mount; Package Quantity: 10000; PackageDescription: 2-Pin Surface Mount Device, Body 1 x 0.5 mm; Packaging: Tape and Reel; PartNumber: ERJ-2RKF1651X; RoHSCompliant: true; Tolerance: 1%; Width: 0.5 mm; Height: 0.35 mm; Mount: Surface Mount; PackageReference: 0402; Pins: 2; REACH SVHC: Yes; Resistance: 1.65 KOhm
R9 = E60: Chip Resistor, 10 KOhm, +/- 1%, 100 mW, -55 to 155 degC, 0402 (1005 Metric), RoHS, Tape and Reel; Manufacturer: Basic Passives; Тип элемента: Резистор; Case\/Package: 0402; Voltage Rating: 50 V; Power Rating: 100 mW; Resistance: 10 KOhm; Old_des: R343; New_des: R9; UID: E60; Component Kind: Standard; Case Code (Imperial): 0402; Case Code (Metric): 1005; ComponentLink1Description: Manufacturer URL; ComponentLink1URL: http://www.panasonic.com/; ComponentLink2Description: Datasheet; ComponentLink2URL: http://industrial.panasonic.com/cdbs/www-data/pdf/RDA0000/AOA0000C86.pdf; DatasheetVersion: 04/2015; Length: 1 mm; Max Operating Temperature: 155 degC; Min Operating Temperature: -55 degC; Mounting Technology: Surface Mount; Package Quantity: 10000; PackageDescription: 2-Pin Surface Mount Device, Body 1 x 0.5 mm; Packaging: Tape and Reel; PartNumber: ERJ-2RKF1002X; RoHSCompliant: true; Tolerance: 1%; Width: 0.5 mm; Height: 0.35 mm; Mount: Surface Mount; PackageReference: 0402; Pins: 2; Radiation Hardening: No; REACH SVHC: Yes

## Sheet USB3 Connector.SchDoc
size 209 x 297 mm; Author: ALTIUM GOSTBOM2.0 KEV; SheetNumber: 48; SheetTotal: 48
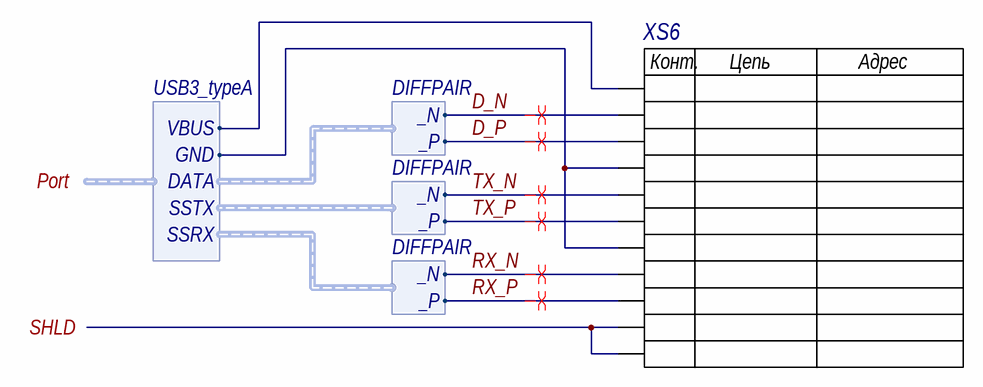
[diagram p34: USB3 Connector.SchDoc]

### Parts
XS6  10117835  [FCI-10117835_V]  (value not drawn)

### Ports
Port (harness USB3_typeA), SHLD

### Harnesses
DIFFPAIR: _P, _N
USB3_typeA: VBUS, DATA, SSTX, SSRX, GND

### Nets
GND: XS6.10(SHLD1) XS6.11(SHLD2) ; port SHLD
D_N: XS6.2(D-) ; harness DIFFPAIR._N
D_P: XS6.3(D+) ; harness DIFFPAIR._P
RX_N: XS6.8(STDA_SSRX-) ; harness DIFFPAIR._N
RX_P: XS6.9(STDA_SSRX+) ; harness DIFFPAIR._P
TX_N: XS6.5(STDA_SSTX-) ; harness DIFFPAIR._N
TX_P: XS6.6(STDA_SSTX+) ; harness DIFFPAIR._P
USB3_port.GND: XS6.4(GND) XS6.7(GND-DRAIN) ; port Port.GND
USB3_port.VBUS: XS6.1(VBUS) ; port Port.VBUS

### Layout directives
differential pair: D_N, D_P, RX_N, RX_P, TX_N, TX_P

### Notes on the sheet
- Подп. дата
- Инв. № дубл.
- Взам. инв. №
- Подп. и дата
- Инв. № подл.
- Изм.
- Лист
- № докум.
- Подп.
- Дата
- Файл:
- ALTIUM GOSTBOM2.0 KEV
- Копировал
- Формат А4
- (in symbol E44) Конт.; Цепь; Адрес

### Library data of the parts
XS6 = E44: USB 3.0 Standard-A Receptacle Right Angle Type Soldering to Board Termination, 30 V, -55 to 85 degC, 9-Pin THD, RoHS, Tray; Тип элемента: Соединитель; Old_des: J22; New_des: XS6; UID: E44; Component Kind: Standard; ComponentLink1Description: Manufacturer URL; ComponentLink1URL: http://portal.fciconnect.com/; ComponentLink2Description: Datasheet; ComponentLink2URL: http://portal.fciconnect.com/Comergent/fci/documentation/gs-12-0928.pdf; DatasheetVersion: Rev. B, 05/2014; Mounting Technology: Through Hole; PackageDescription: 9-Pin Through Hole Device, Body 15.6 x 16.5 mm; PackageReference: 10117835; ComponentLink3Description: Package Specification; ComponentLink3URL: http://portal.fciconnect.com/Comergent/fci/drawing/10117835.pdf; ClassName: A3

## Sheet Core Supply Filter.SchDoc
size 420 x 297 mm; Author: ALTIUM GOSTBOM2.0 KEV; SheetNumber: 18; SheetTotal: 48
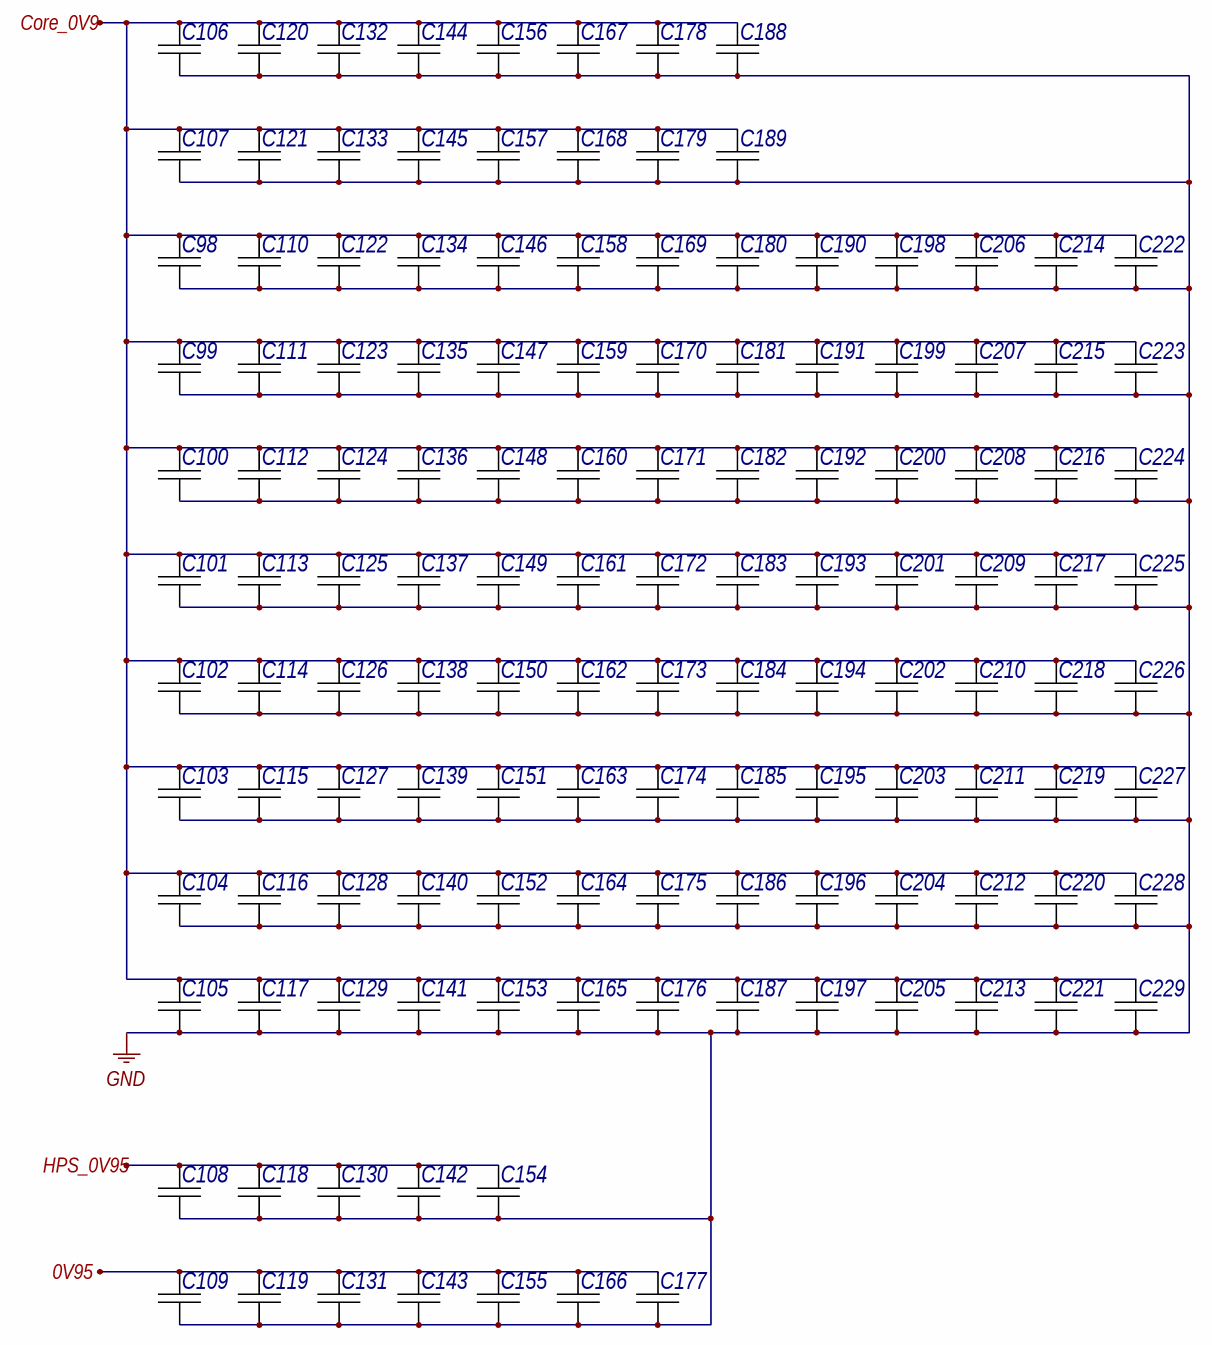
[diagram p35: Core Supply Filter.SchDoc]

### Parts
C98  GRM033R60J104KE19D  [CAPC0603X33X15LL03T05]  (value not drawn)
C99  GRM033R60J104KE19D  [CAPC0603X33X15LL03T05]  (value not drawn)
C100  GRM033R60J104KE19D  [CAPC0603X33X15LL03T05]  (value not drawn)
C101  GRM033R60J104KE19D  [CAPC0603X33X15LL03T05]  (value not drawn)
C102  GRM033R60J104KE19D  [CAPC0603X33X15LL03T05]  (value not drawn)
C103  GRM033R60J104KE19D  [CAPC0603X33X15LL03T05]  (value not drawn)
C104  GRM033R60J104KE19D  [CAPC0603X33X15LL03T05]  (value not drawn)
C105  GRM033R60J104KE19D  [CAPC0603X33X15LL03T05]  (value not drawn)
C106  GRM31CR60J107ME39L  [CAPC3216X190X55ML30T25]  (value not drawn)
C107  GRM31CR60J107ME39L  [CAPC3216X190X55ML30T25]  (value not drawn)
C108  GRM31CR60J107ME39L  [CAPC3216X190X55ML30T25]  (value not drawn)
C109  GRM31CR60J107ME39L  [CAPC3216X190X55ML30T25]  (value not drawn)
C110  GRM033R60J104KE19D  [CAPC0603X33X15LL03T05]  (value not drawn)
C111  GRM033R60J104KE19D  [CAPC0603X33X15LL03T05]  (value not drawn)
C112  GRM033R60J104KE19D  [CAPC0603X33X15LL03T05]  (value not drawn)
C113  GRM033R60J104KE19D  [CAPC0603X33X15LL03T05]  (value not drawn)
C114  GRM033R60J104KE19D  [CAPC0603X33X15LL03T05]  (value not drawn)
C115  GRM033R60J104KE19D  [CAPC0603X33X15LL03T05]  (value not drawn)
C116  GRM033R60J104KE19D  [CAPC0603X33X15LL03T05]  (value not drawn)
C117  GRM033R60J104KE19D  [CAPC0603X33X15LL03T05]  (value not drawn)
C118  GRM033R60J104KE19D  [CAPC0603X33X15LL03T05]  (value not drawn)
C119  GRM033R60J104KE19D  [CAPC0603X33X15LL03T05]  (value not drawn)
C120  GRM31CR60J107ME39L  [CAPC3216X190X55ML30T25]  (value not drawn)
C121  GRM31CR60J107ME39L  [CAPC3216X190X55ML30T25]  (value not drawn)
C122  GRM033R60J104KE19D  [CAPC0603X33X15LL03T05]  (value not drawn)
C123  GRM033R60J104KE19D  [CAPC0603X33X15LL03T05]  (value not drawn)
C124  GRM033R60J104KE19D  [CAPC0603X33X15LL03T05]  (value not drawn)
C125  GRM033R60J104KE19D  [CAPC0603X33X15LL03T05]  (value not drawn)
C126  GRM033R60J104KE19D  [CAPC0603X33X15LL03T05]  (value not drawn)
C127  GRM033R60J104KE19D  [CAPC0603X33X15LL03T05]  (value not drawn)
C128  GRM033R60J104KE19D  [CAPC0603X33X15LL03T05]  (value not drawn)
C129  GRM033R60J104KE19D  [CAPC0603X33X15LL03T05]  (value not drawn)
C130  GRM033R60J104KE19D  [CAPC0603X33X15LL03T05]  (value not drawn)
C131  GRM033R60J104KE19D  [CAPC0603X33X15LL03T05]  (value not drawn)
C132  GRM31CR60J107ME39L  [CAPC3216X190X55ML30T25]  (value not drawn)
C133  GRM31CR60J107ME39L  [CAPC3216X190X55ML30T25]  (value not drawn)
C134  GRM033R60J104KE19D  [CAPC0603X33X15LL03T05]  (value not drawn)
C135  GRM033R60J104KE19D  [CAPC0603X33X15LL03T05]  (value not drawn)
C136  GRM033R60J104KE19D  [CAPC0603X33X15LL03T05]  (value not drawn)
C137  GRM033R60J104KE19D  [CAPC0603X33X15LL03T05]  (value not drawn)
C138  GRM033R60J104KE19D  [CAPC0603X33X15LL03T05]  (value not drawn)
C139  GRM033R60J104KE19D  [CAPC0603X33X15LL03T05]  (value not drawn)
C140  GRM033R60J104KE19D  [CAPC0603X33X15LL03T05]  (value not drawn)
C141  GRM033R60J104KE19D  [CAPC0603X33X15LL03T05]  (value not drawn)
C142  GRM033R60J104KE19D  [CAPC0603X33X15LL03T05]  (value not drawn)
C143  GRM033R60J104KE19D  [CAPC0603X33X15LL03T05]  (value not drawn)
C144  GRM31CR60J107ME39L  [CAPC3216X190X55ML30T25]  (value not drawn)
C145  GRM31CR60J107ME39L  [CAPC3216X190X55ML30T25]  (value not drawn)
C146  GRM033R60J104KE19D  [CAPC0603X33X15LL03T05]  (value not drawn)
C147  GRM033R60J104KE19D  [CAPC0603X33X15LL03T05]  (value not drawn)
C148  GRM033R60J104KE19D  [CAPC0603X33X15LL03T05]  (value not drawn)
C149  GRM033R60J104KE19D  [CAPC0603X33X15LL03T05]  (value not drawn)
C150  GRM033R60J104KE19D  [CAPC0603X33X15LL03T05]  (value not drawn)
C151  GRM033R60J104KE19D  [CAPC0603X33X15LL03T05]  (value not drawn)
C152  GRM033R60J104KE19D  [CAPC0603X33X15LL03T05]  (value not drawn)
C153  GRM033R60J104KE19D  [CAPC0603X33X15LL03T05]  (value not drawn)
C154  GRM033R60J104KE19D  [CAPC0603X33X15LL03T05]  (value not drawn)
C155  GRM033R60J104KE19D  [CAPC0603X33X15LL03T05]  (value not drawn)
C156  GRM31CR60J107ME39L  [CAPC3216X190X55ML30T25]  (value not drawn)
C157  GRM31CR60J107ME39L  [CAPC3216X190X55ML30T25]  (value not drawn)
C158  GRM033R60J104KE19D  [CAPC0603X33X15LL03T05]  (value not drawn)
C159  GRM033R60J104KE19D  [CAPC0603X33X15LL03T05]  (value not drawn)
C160  GRM033R60J104KE19D  [CAPC0603X33X15LL03T05]  (value not drawn)
C161  GRM033R60J104KE19D  [CAPC0603X33X15LL03T05]  (value not drawn)
C162  GRM033R60J104KE19D  [CAPC0603X33X15LL03T05]  (value not drawn)
C163  GRM033R60J104KE19D  [CAPC0603X33X15LL03T05]  (value not drawn)
C164  GRM033R60J104KE19D  [CAPC0603X33X15LL03T05]  (value not drawn)
C165  GRM033R60J104KE19D  [CAPC0603X33X15LL03T05]  (value not drawn)
C166  GRM033R60J104KE19D  [CAPC0603X33X15LL03T05]  (value not drawn)
C167  GRM31CR60J107ME39L  [CAPC3216X190X55ML30T25]  (value not drawn)
C168  GRM31CR60J107ME39L  [CAPC3216X190X55ML30T25]  (value not drawn)
C169  GRM033R60J104KE19D  [CAPC0603X33X15LL03T05]  (value not drawn)
C170  GRM033R60J104KE19D  [CAPC0603X33X15LL03T05]  (value not drawn)
C171  GRM033R60J104KE19D  [CAPC0603X33X15LL03T05]  (value not drawn)
C172  GRM033R60J104KE19D  [CAPC0603X33X15LL03T05]  (value not drawn)
C173  GRM033R60J104KE19D  [CAPC0603X33X15LL03T05]  (value not drawn)
C174  GRM033R60J104KE19D  [CAPC0603X33X15LL03T05]  (value not drawn)
C175  GRM033R60J104KE19D  [CAPC0603X33X15LL03T05]  (value not drawn)
C176  GRM033R60J104KE19D  [CAPC0603X33X15LL03T05]  (value not drawn)
C177  GRM033R60J104KE19D  [CAPC0603X33X15LL03T05]  (value not drawn)
C178  GRM31CR60J107ME39L  [CAPC3216X190X55ML30T25]  (value not drawn)
C179  GRM31CR60J107ME39L  [CAPC3216X190X55ML30T25]  (value not drawn)
C180  GRM033R60J104KE19D  [CAPC0603X33X15LL03T05]  (value not drawn)
C181  GRM033R60J104KE19D  [CAPC0603X33X15LL03T05]  (value not drawn)
C182  GRM033R60J104KE19D  [CAPC0603X33X15LL03T05]  (value not drawn)
C183  GRM033R60J104KE19D  [CAPC0603X33X15LL03T05]  (value not drawn)
C184  GRM033R60J104KE19D  [CAPC0603X33X15LL03T05]  (value not drawn)
C185  GRM033R60J104KE19D  [CAPC0603X33X15LL03T05]  (value not drawn)
C186  GRM033R60J104KE19D  [CAPC0603X33X15LL03T05]  (value not drawn)
C187  GRM033R60J104KE19D  [CAPC0603X33X15LL03T05]  (value not drawn)
C188  GRM31CR60J107ME39L  [CAPC3216X190X55ML30T25]  (value not drawn)
C189  GRM31CR60J107ME39L  [CAPC3216X190X55ML30T25]  (value not drawn)
C190  GRM033R60J104KE19D  [CAPC0603X33X15LL03T05]  (value not drawn)
C191  GRM033R60J104KE19D  [CAPC0603X33X15LL03T05]  (value not drawn)
C192  GRM033R60J104KE19D  [CAPC0603X33X15LL03T05]  (value not drawn)
C193  GRM033R60J104KE19D  [CAPC0603X33X15LL03T05]  (value not drawn)
C194  GRM033R60J104KE19D  [CAPC0603X33X15LL03T05]  (value not drawn)
C195  GRM033R60J104KE19D  [CAPC0603X33X15LL03T05]  (value not drawn)
C196  GRM033R60J104KE19D  [CAPC0603X33X15LL03T05]  (value not drawn)
C197  GRM033R60J104KE19D  [CAPC0603X33X15LL03T05]  (value not drawn)
C198  GRM033R60J104KE19D  [CAPC0603X33X15LL03T05]  (value not drawn)
C199  GRM033R60J104KE19D  [CAPC0603X33X15LL03T05]  (value not drawn)
C200  GRM033R60J104KE19D  [CAPC0603X33X15LL03T05]  (value not drawn)
C201  GRM033R60J104KE19D  [CAPC0603X33X15LL03T05]  (value not drawn)
C202  GRM033R60J104KE19D  [CAPC0603X33X15LL03T05]  (value not drawn)
C203  GRM033R60J104KE19D  [CAPC0603X33X15LL03T05]  (value not drawn)
C204  GRM033R60J104KE19D  [CAPC0603X33X15LL03T05]  (value not drawn)
C205  GRM033R60J104KE19D  [CAPC0603X33X15LL03T05]  (value not drawn)
C206  GRM033R60J104KE19D  [CAPC0603X33X15LL03T05]  (value not drawn)
C207  GRM033R60J104KE19D  [CAPC0603X33X15LL03T05]  (value not drawn)
C208  GRM033R60J104KE19D  [CAPC0603X33X15LL03T05]  (value not drawn)
C209  GRM033R60J104KE19D  [CAPC0603X33X15LL03T05]  (value not drawn)
C210  GRM033R60J104KE19D  [CAPC0603X33X15LL03T05]  (value not drawn)
C211  GRM033R60J104KE19D  [CAPC0603X33X15LL03T05]  (value not drawn)
C212  GRM033R60J104KE19D  [CAPC0603X33X15LL03T05]  (value not drawn)
C213  GRM033R60J104KE19D  [CAPC0603X33X15LL03T05]  (value not drawn)
C214  GRM033R60J104KE19D  [CAPC0603X33X15LL03T05]  (value not drawn)
C215  GRM033R60J104KE19D  [CAPC0603X33X15LL03T05]  (value not drawn)
C216  GRM033R60J104KE19D  [CAPC0603X33X15LL03T05]  (value not drawn)
C217  GRM033R60J104KE19D  [CAPC0603X33X15LL03T05]  (value not drawn)
C218  GRM033R60J104KE19D  [CAPC0603X33X15LL03T05]  (value not drawn)
C219  GRM033R60J104KE19D  [CAPC0603X33X15LL03T05]  (value not drawn)
C220  GRM033R60J104KE19D  [CAPC0603X33X15LL03T05]  (value not drawn)
C221  GRM033R60J104KE19D  [CAPC0603X33X15LL03T05]  (value not drawn)
C222  GRM033R60J104KE19D  [CAPC0603X33X15LL03T05]  (value not drawn)
C223  GRM033R60J104KE19D  [CAPC0603X33X15LL03T05]  (value not drawn)
C224  GRM033R60J104KE19D  [CAPC0603X33X15LL03T05]  (value not drawn)
C225  GRM033R60J104KE19D  [CAPC0603X33X15LL03T05]  (value not drawn)
C226  GRM033R60J104KE19D  [CAPC0603X33X15LL03T05]  (value not drawn)
C227  GRM033R60J104KE19D  [CAPC0603X33X15LL03T05]  (value not drawn)
C228  GRM033R60J104KE19D  [CAPC0603X33X15LL03T05]  (value not drawn)
C229  GRM033R60J104KE19D  [CAPC0603X33X15LL03T05]  (value not drawn)

### Ports
0V95, Core_0V9, HPS_0V95

### Nets
GND: C98.1 C99.1 C100.1 C101.1 C102.1 C103.1 C104.1 C105.1 C106.1 C107.1 C108.1 C109.1 C110.1 C111.1 C112.1 C113.1 C114.1 C115.1 C116.1 C117.1 C118.1 C119.1 C120.1 C121.1 C122.1 C123.1 C124.1 C125.1 C126.1 C127.1 C128.1 C129.1 C130.1 C131.1 C132.1 C133.1 C134.1 C135.1 C136.1 C137.1 C138.1 C139.1 C140.1 C141.1 C142.1 C143.1 C144.1 C145.1 C146.1 C147.1 C148.1 C149.1 C150.1 C151.1 C152.1 C153.1 C154.1 C155.1 C156.1 C157.1 C158.1 C159.1 C160.1 C161.1 C162.1 C163.1 C164.1 C165.1 C166.1 C167.1 C168.1 C169.1 C170.1 C171.1 C172.1 C173.1 C174.1 C175.1 C176.1 C177.1 C178.1 C179.1 C180.1 C181.1 C182.1 C183.1 C184.1 C185.1 C186.1 C187.1 C188.1 C189.1 C190.1 C191.1 C192.1 C193.1 C194.1 C195.1 C196.1 C197.1 C198.1 C199.1 C200.1 C201.1 C202.1 C203.1 C204.1 C205.1 C206.1 C207.1 C208.1 C209.1 C210.1 C211.1 C212.1 C213.1 C214.1 C215.1 C216.1 C217.1 C218.1 C219.1 C220.1 C221.1 C222.1 C223.1 C224.1 C225.1 C226.1 C227.1 C228.1 C229.1
NetC98_2: C98.2 C99.2 C100.2 C101.2 C102.2 C103.2 C104.2 C105.2 C106.2 C107.2 C110.2 C111.2 C112.2 C113.2 C114.2 C115.2 C116.2 C117.2 C120.2 C121.2 C122.2 C123.2 C124.2 C125.2 C126.2 C127.2 C128.2 C129.2 C132.2 C133.2 C134.2 C135.2 C136.2 C137.2 C138.2 C139.2 C140.2 C141.2 C144.2 C145.2 C146.2 C147.2 C148.2 C149.2 C150.2 C151.2 C152.2 C153.2 C156.2 C157.2 C158.2 C159.2 C160.2 C161.2 C162.2 C163.2 C164.2 C165.2 C167.2 C168.2 C169.2 C170.2 C171.2 C172.2 C173.2 C174.2 C175.2 C176.2 C178.2 C179.2 C180.2 C181.2 C182.2 C183.2 C184.2 C185.2 C186.2 C187.2 C188.2 C189.2 C190.2 C191.2 C192.2 C193.2 C194.2 C195.2 C196.2 C197.2 C198.2 C199.2 C200.2 C201.2 C202.2 C203.2 C204.2 C205.2 C206.2 C207.2 C208.2 C209.2 C210.2 C211.2 C212.2 C213.2 C214.2 C215.2 C216.2 C217.2 C218.2 C219.2 C220.2 C221.2 C222.2 C223.2 C224.2 C225.2 C226.2 C227.2 C228.2 C229.2 ; port Core_0V9
NetC108_2: C108.2 C118.2 C130.2 C142.2 C154.2 ; port HPS_0V95
NetC109_2: C109.2 C119.2 C131.2 C143.2 C155.2 C166.2 C177.2 ; port 0V95

### Notes on the sheet
- Подп. дата
- Инв. № дубл.
- Взам. инв. №
- Подп. и дата
- Инв. № подл.
- Изм.
- Лист
- № докум.
- Подп.
- Дата
- ALTIUM GOSTBOM2.0 KEV
- Файл:
- Копировал
- Формат А3